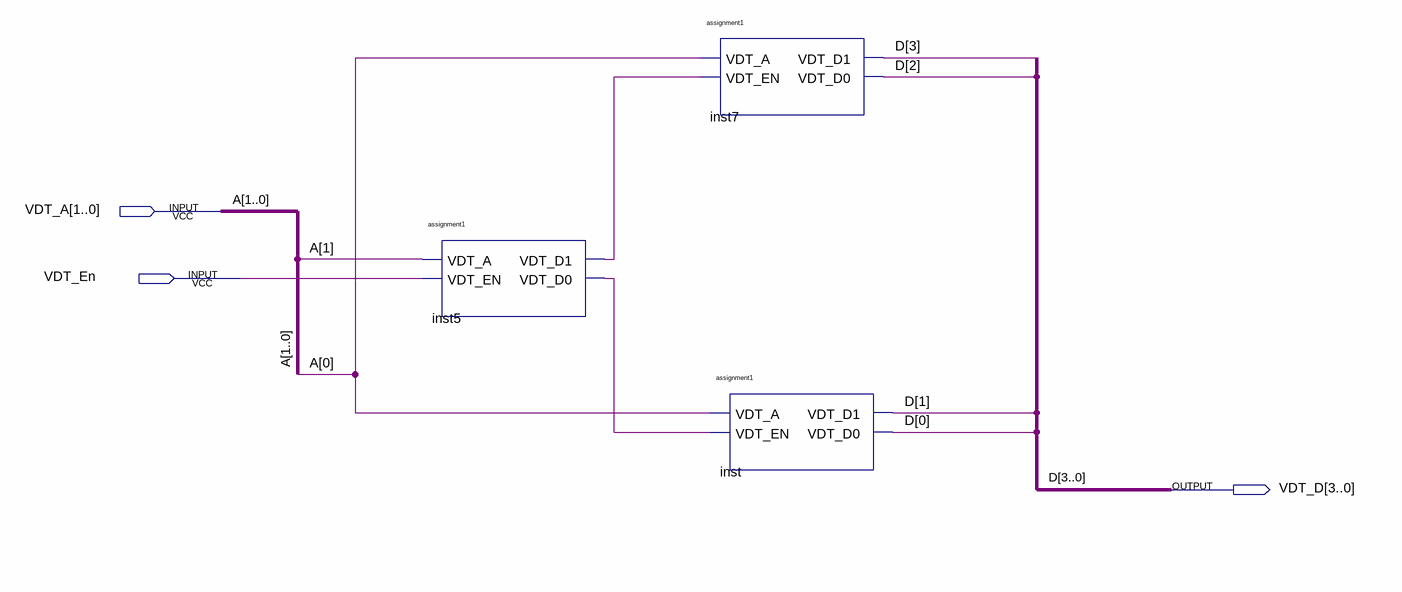
[diagram p0: schematic sheet]
// Quartus schematic assignment2.bdf as structural Verilog: 3 symbols, 3 pins
module assignment2 (
  input  [1:0] VDT_A,
  input  VDT_En,
  output [3:0] VDT_D
);

  wire inst5_vdt_d0, inst5_vdt_d1;

  assignment1 inst5 (.VDT_A(VDT_A[1]), .VDT_EN(VDT_En), .VDT_D1(inst5_vdt_d1), .VDT_D0(inst5_vdt_d0));
  assignment1 inst7 (.VDT_A(VDT_A[0]), .VDT_EN(inst5_vdt_d1), .VDT_D1(VDT_D[3]), .VDT_D0(VDT_D[2]));
  assignment1 inst (.VDT_A(VDT_A[0]), .VDT_EN(inst5_vdt_d0), .VDT_D1(VDT_D[1]), .VDT_D0(VDT_D[0]));

  // Other names for the same wires on the sheet: A[1:0] = VDT_A; D[3:0] = VDT_D
endmodule
